# EasyEDA Pro project stm32f030f4p6_board.eprj

# Schematic Schematic1
Create Date: 2024-07-15; Page Name: P1; Project Name: stm32f030f4p6_board(1); Schematic Name: Schematic1; Update Date: 2024-07-22; Company: 嘉立创EDA; Page Size: A4; Version: V1.0
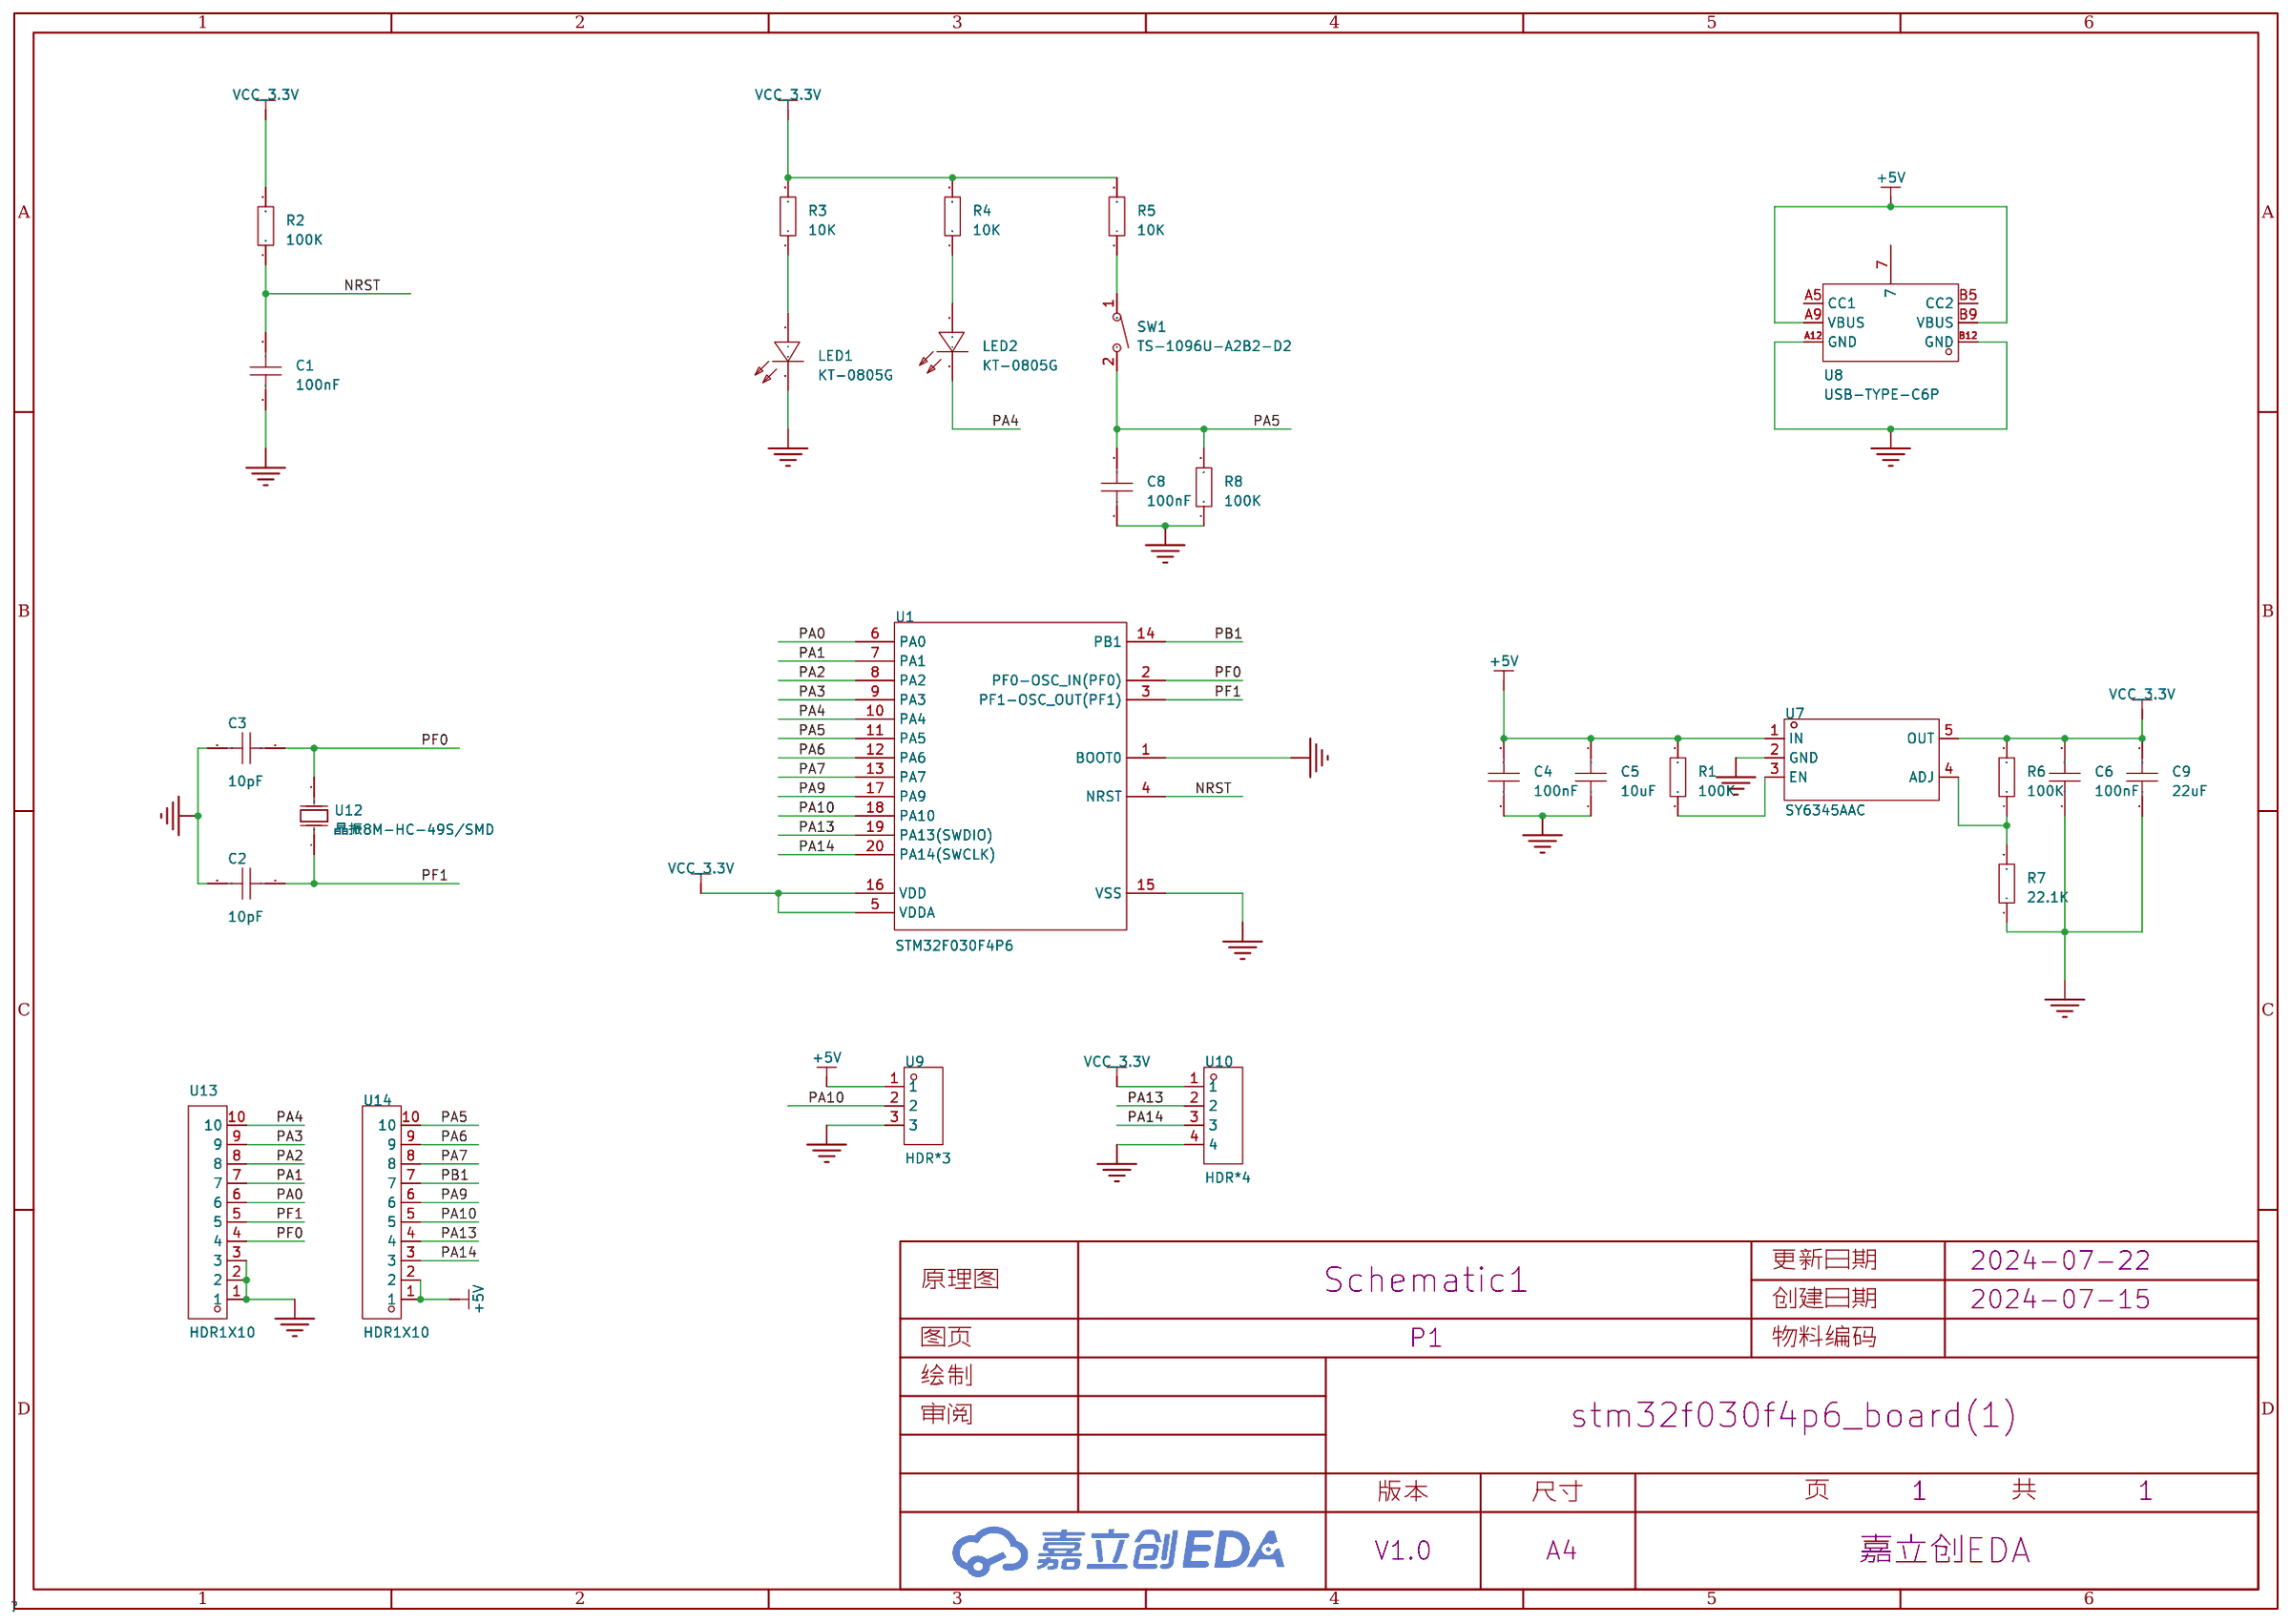
[diagram p0: schematic sheet]

## Parts
C1  100nF  [C0603]
C2  10pF  [C0603]
C3  10pF  [C0603]
C4  100nF  [C0603]
C5  10uF  [C0603]
C6  100nF  [C0603]
C8  100nF  [C0603]
C9  22uF  [C0805]
LED1  KT-0805G  [LED0805-R-RD]
LED2  KT-0805G  [LED0805-R-RD]
R1  100K  [R0603]
R2  100K  [R0603]
R3  10K  [R0603]
R4  10K  [R0603]
R5  10K  [R0603]
R6  100K  [R0603]
R7  22.1K  [R0603]
R8  100K  [R0603]
SW1  TS-1096U-A2B2-D2  [SW-SMD_L6.0-W3.3-LS6.7]
U1  STM32F030F4P6  [TSSOP-20_L6.5-W4.4-P0.65-LS6.4-BL]
U7  SY6345AAC  [SOT-23-5_L3.0-W1.7-P0.95-LS2.8-BR]
U8  USB-TYPE-C6P  [TYPE-C-SMD_TYPE-C-6P-1]
U9  HDR*3  [HDR-TH_3P-P2.54-V-M-A]
U10  HDR*4  [HDR-TH_4P-P2.54-V-F]
U12  晶振8M-HC-49S/SMD  [HC-49S_L11.4-W4.8-LS12.7]
U13  HDR1X10  [HDR-TH_10P-P2.54-V-F_C9900008052]
U14  HDR1X10  [HDR-TH_10P-P2.54-V-F_C9900008052]

## Library data of the parts
C1-C6 C8 = CAP_0603: Supplier Footprint: 0603
C9 = CAP_0805: Supplier Footprint: 0805
LED1 LED2 = KT-0805G: 灯头类型:-;发光颜色:翠绿色;正向电压(VF):-;功率:-;正向电流:-;主波长:-;二极管配置:-;透镜颜色:-;色温:-;发光强度:-;发光角度:-;载带方式:-;工作温度:-;; LCSC Part Name: 0805 翠绿 高亮; Supplier Part: C2297; Manufacturer: KENTO; Supplier Footprint: 0805; JLCPCB Part Class: 基础库; Datasheet: https://atta.szlcsc.com/upload/public/pdf/source/20170209/1486607340485.pdf; Supplier: LCSC; Emitted Color: 翠绿色
R1-R8 = Res_0603: Supplier Footprint: 0603
SW1 = TS-1096U-A2B2-D2: 电路结构:单刀单掷;按钮形状:矩形按钮;作用力:180gf;安装方式:-;开关长度:6mm;开关宽度:3.3mm;开关高度:5mm;带灯:-;机械寿命:-;; LCSC Part Name: 轻触开关3*6*5.0mm全白色包脚U型两脚贴片180gf; Supplier Part: C492868; Manufacturer: Yuandi(元迪); JLCPCB Part Class: 扩展库; Datasheet: https://atta.szlcsc.com/upload/public/pdf/source/20200316/C492864_47CE8F1A4ACE7107CDAF759D28B1DF3B.pdf; Supplier: LCSC; Circuit: 单刀单掷; Actuator Style: 矩形按钮; Operating Force: 180gf; Switch Length: 6mm; Switch Width: 3.3mm; Switch Height: 5mm
U1 = STM32F030F4P6: CPU内核:CM0;程序存储容量:16KB;RAM总容量:4KB;GPIO端口数量:15;工作电压范围:2.4V~3.6V;CPU最大主频:48MHz;程序存储器类型:FLASH;; LCSC Part Name: 基于ARM®的32位MCU，具有高达256KB的闪存，定时器，ADC，通信接口，2.4V-3.6V操作; Supplier Part: C32908; Manufacturer: ST(意法半导体); Supplier Footprint: TSSOP-20; JLCPCB Part Class: 扩展库; Datasheet: https://atta.szlcsc.com/upload/public/pdf/source/20150124/1457707258011.pdf; Supplier: LCSC; CPU Core: CM0; Program Storage Size: 16KB; RAM Size: 4KB; GPIO Ports Number: 15; Operating Voltage Range: 2.4V~3.6V; CPU Maximum Speed: 48MHz; Program Memory Type: FLASH; Operating Temperature Range: -40℃~+85℃; ADC (Bit): 12bit; Watchdog: 有; Low-Voltage Detect: 有; Direct Memory Access: 有; Internal Oscillator: 有
U7 = SY6345AAC: 输出类型:-;; Supplier Part: C98119; Manufacturer: silergy(矽力杰); Supplier Footprint: SOT-23-5; JLCPCB Part Class: 扩展库; Datasheet: https://atta.szlcsc.com/upload/public/pdf/source/20170314/1489464462463.pdf; Supplier: LCSC
U8 = USB-TYPE-C6P: Supplier Part: C9900001831; Supplier Footprint: TYPE-C_L8.94-W6.8P1.00; JLCPCB Part Class: 扩展库; Supplier: LCSC
U9 = TXM_3: Supplier Part: C9900014923; Supplier Footprint: 排针; JLCPCB Part Class: 扩展库; Supplier: LCSC
U10 = HC-08蓝牙: Supplier Part: C9900016778; Supplier Footprint: HDR-TH_4P; JLCPCB Part Class: 扩展库; Supplier: LCSC
U12 = 晶振8M-HC-49S/SMD: Supplier Part: C9900009291; Supplier Footprint: SMD; JLCPCB Part Class: 扩展库; Supplier: LCSC
U13 U14 = HDR1X10: Supplier Part: C9900008052; Supplier Footprint: 1X10P2.54mm塑高3.5mm; JLCPCB Part Class: 扩展库; Supplier: LCSC

## Nets
+5V: C4.2 C5.2 R1.1 U7.1(IN) U8.A9(VBUS) U8.B9(VBUS) U9.1 U14.1 U14.2
GND: C1.1 C2.2 C3.2 C4.1 C5.1 C6.1 C8.1 C9.1 LED1.2(K) R7.1 R8.1 U1.1(BOOT0) U1.15(VSS) U7.2(GND) U8.A12(GND) U8.B12(GND) U9.3 U10.4 U13.1 U13.2 U13.3
VCC_3.3V: C6.2 C9.2 R2.2 R3.2 R4.2 R5.2 R6.2 U1.5(VDDA) U1.16(VDD) U7.5(OUT) U10.1
NRST: C1.2 R2.1 U1.4(NRST)
PA0: U1.6(PA0) U13.6
PA1: U1.7(PA1) U13.7
PA2: U1.8(PA2) U13.8
PA3: U1.9(PA3) U13.9
PA4: LED2.2(K) U1.10(PA4) U13.10
PA5: C8.2 R8.2 SW1.2 U1.11(PA5) U14.10
PA6: U1.12(PA6) U14.9
PA7: U1.13(PA7) U14.8
PA9: U1.17(PA9) U14.6
PA10: U1.18(PA10) U9.2 U14.5
PA13: U1.19(PA13(SWDIO)) U10.2 U14.4
PA14: U1.20(PA14(SWCLK)) U10.3 U14.3
PB1: U1.14(PB1) U14.7
PF0: C3.1 U1.2(PF0-OSC_IN(PF0)) U12.2(OSC2) U13.4
PF1: C2.1 U1.3(PF1-OSC_OUT(PF1)) U12.1(OSC1) U13.5
$1N1748: LED1.1(A) R3.1
$1N1829: LED2.1(A) R4.1
$1N2327: R1.2 U7.3(EN)
$1N2395: R6.1 R7.2 U7.4(ADJ)
$1N2536: R5.1 SW1.1

Not connected (* = marked no-connect by the designer): U8 7 A5(CC1) B5(CC2)

# Board PCB1
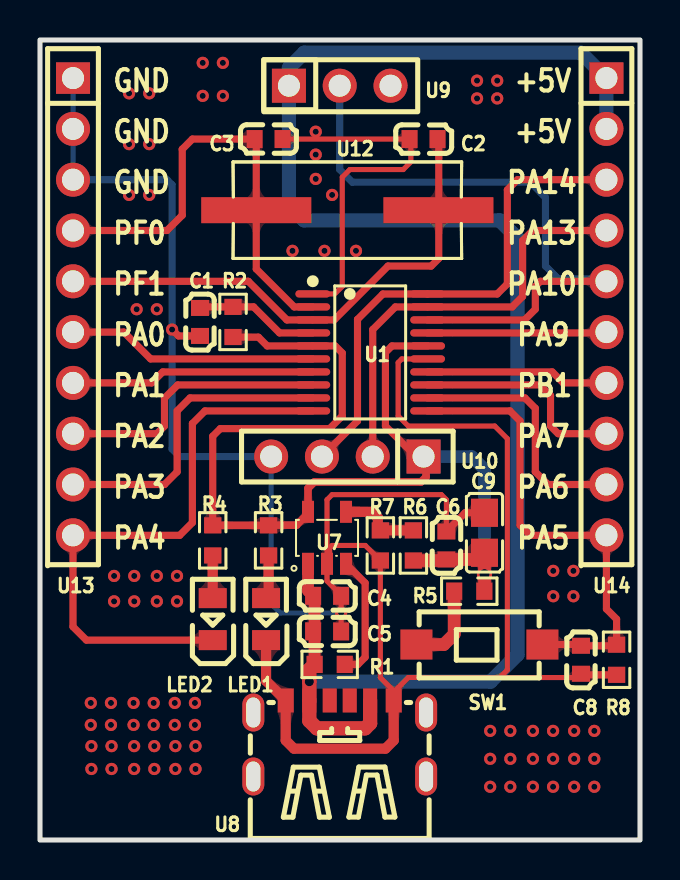
[diagram p1: board, top side]
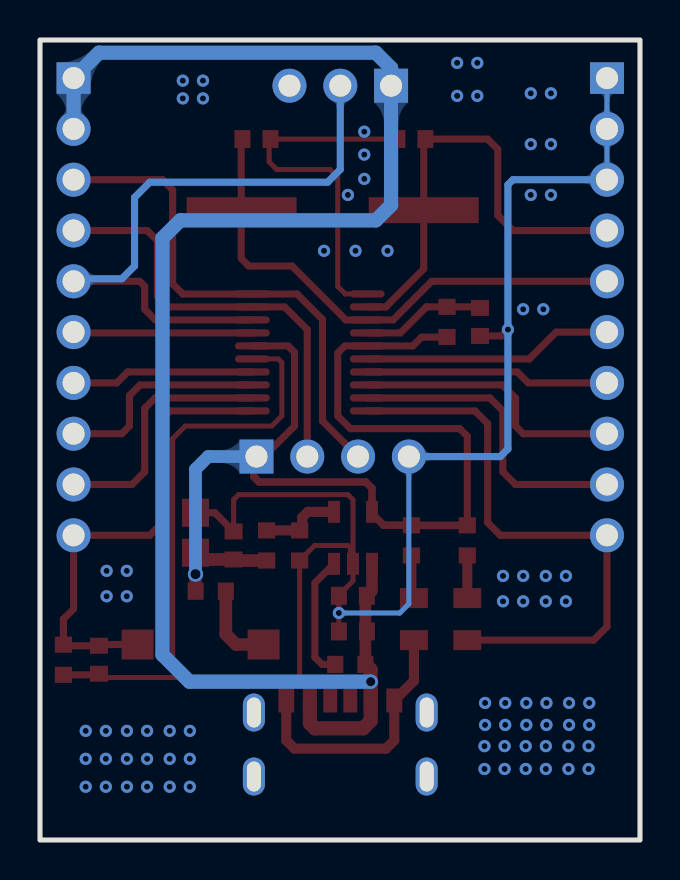
[diagram p2: board, bottom side, seen from below]

Outline 30 x 40 mm; copper layers: Top Layer, Bottom Layer. Coordinates in mm from the lower left corner of the outline.
Outline path: rectangle 0,40 30,0
Stack: Top Layer 0.035mm / Dielectric1 1.51mm FR4 er 4.5 / Bottom Layer 0.035mm

## Design rules (mm)
template: 自定义配置
spacing copperThickness1oz (default): track to track 0.102, other pairs 0.152 to 0.3
spacing copperThickness2oz: track to track 0.203, other pairs 0.152 to 0.3
track width copperThickness1oz (default): min 0.127, default 0.254, max 2.54
track width copperThickness2oz: min 0.203, default 0.254, max 2.54
differential pair differentialPair (default): width min 0.127, default 0.254, max 2.54; gap min 0.152, default 0.152
via viaSize (default): diameter min 0.5, default 0.61, max 10; hole min 0.3, default 0.305, max 6.299

## Placement (name value [footprint] x y rotation side)
C1  100nF  [C0603]  8 25.9 90 top
C2  10pF  [C0603]  19.18 35.05 180 top
C3  10pF  [C0603]  11.43 35.05 0 top
C4  100nF  [C0603]  14.36 12.21 180 top
C5  10uF  [C0603]  14.36 10.43 180 top
C6  100nF  [C0603]  20.32 14.73 270 top
C8  100nF  [C0603]  27.05 9.01 90 top
C9  22uF  [C0805]  22.22 15.36 270 top
LED1  KT-0805G  [LED0805-R-RD]  11.3 11.04 90 top
LED2  KT-0805G  [LED0805-R-RD]  8.64 11.04 90 top
R1  100K  [R0603]  14.48 8.78 0 top
R2  100K  [R0603]  9.65 25.9 270 top
R3  10K  [R0603]  11.43 14.98 90 top
R4  10K  [R0603]  8.64 14.98 90 top
R5  10K  [R0603]  21.46 12.44 0 top
R6  100K  [R0603]  18.67 14.73 270 top
R7  22.1K  [R0603]  17.02 14.73 90 top
R8  100K  [R0603]  28.83 9.01 90 top
SW1  TS-1096U-A2B2-D2  [SW-SMD_L6.0-W3.3-LS6.7]  21.97 9.77 0 top
U1  STM32F030F4P6  [TSSOP-20_L6.5-W4.4-P0.65-LS6.4-BL]  16.51 24.38 270 top
U7  SY6345AAC  [SOT-23-5_L3.0-W1.7-P0.95-LS2.8-BR]  14.35 15.11 270 top
U8  USB-TYPE-C6P  [TYPE-C-SMD_TYPE-C-6P-1]  14.99 5.08 0 top
U9  HDR*3  [HDR-TH_3P-P2.54-V-M-A]  14.99 37.71 0 top
U10  HDR*4  [HDR-TH_4P-P2.54-V-F]  15.37 19.17 180 top
U12  晶振8M-HC-49S/SMD  [HC-49S_L11.4-W4.8-LS12.7]  15.37 31.49 180 top
U13  HDR1X10  [HDR-TH_10P-P2.54-V-F_C9900008052]  1.65 26.67 270 top
U14  HDR1X10  [HDR-TH_10P-P2.54-V-F_C9900008052]  28.32 26.67 270 top

## Footprints (pads in the part's own frame, mm; a bottom-side part is the same pattern mirrored in y, then rotated)
C0603
  rect 0.8x0.9 smd: 1(-0.7,0) 2(0.7,0)
C0805
  rect 1.41x1.35 smd: 1(-1,0) 2(1,0)
HC-49S_L11.4-W4.8-LS12.7
  rect 5.5x1.3 smd: 1(-4.553,0) 2(4.553,0)
HDR-TH_3P-P2.54-V-M-A
  rect 1.7x1.7 hole 1.1: 1(-2.54,0)
  round 1.7 hole 1.1: 2(0,0) 3(2.54,0)
HDR-TH_4P-P2.54-V-F
  rect 1.7x1.7 hole 1.1: 1(-3.81,0)
  round 1.7 hole 1.1: 2(-1.27,0) 3(1.27,0) 4(3.81,0)
HDR-TH_10P-P2.54-V-F_C9900008052
  rect 1.575x1.7 hole 1.1: 1(-11.43,0)
  round 1.7 hole 1.1: 2(-8.89,0) 3(-6.35,0) 4(-3.81,0) 5(-1.27,0) 6(1.27,0) 7(3.81,0) 8(6.35,0) 9(8.89,0) 10(11.43,0)
LED0805-R-RD
  rect 1x1.399 smd: 1(1.05,0) 2(-1.05,0)
R0603
  rect 0.806x0.864 smd: 1(-0.753,0) 2(0.753,0)
SOT-23-5_L3.0-W1.7-P0.95-LS2.8-BR
  rect 1.1x0.6 smd: 1(1.3,-0.95) 2(1.3,0) 3(1.3,0.95) 4(-1.3,0.95) 5(-1.3,-0.95)
SW-SMD_L6.0-W3.3-LS6.7
  rect 1.6x1.5 smd: 1(-3.15,0) 2(3.15,0)
TSSOP-20_L6.5-W4.4-P0.65-LS6.4-BL
  oval 0.364x1.742 smd: 1(-2.925,-2.871) 2(-2.275,-2.871) 3(-1.625,-2.871) 4(-0.975,-2.871) 5(-0.325,-2.871) 6(0.325,-2.871) 7(0.975,-2.871) 8(1.625,-2.871) 9(2.275,-2.871) 10(2.925,-2.871) 11(2.925,2.871) 12(2.275,2.871) 13(1.625,2.871) 14(0.975,2.871) 15(0.325,2.871) 16(-0.325,2.871) 17(-0.975,2.871) 18(-1.625,2.871) 19(-2.275,2.871) 20(-2.925,2.871)
TYPE-C-SMD_TYPE-C-6P-1
  oval 1.1x1.9 hole 0.7x1.5: 7(-4.32,1.3) 7(-4.32,-1.9) 7(4.32,1.3) 7(4.32,-1.9)
  rect 0.7x1.2 smd: A5(-0.5,1.9) A9(1.52,1.9) B5(0.5,1.9) B9(-1.52,1.9)
  rect 0.8x1.2 smd: A12(2.7,1.9) B12(-2.7,1.9)

## Nets
As in the schematic.

Pads without a net: U8 7 A5 B5

## Via types
v1: diameter 0.61, hole 0.305, Top Layer to Bottom Layer, 79 vias
v2: diameter 0.762, hole 0.508, Top Layer to Bottom Layer, 1 via
v3: diameter 0.711, hole 0.457, Top Layer to Bottom Layer, 1 via

## Routing (per net, layer and track width the routed paths; a pad name or vN(x,y) marks a point on that pad's centre or on a via; arc(x,y) is an arc through that point)
+5V: length 82.6
  Top Layer w0.584: U7.1 13.4,12.46 C4.2 13.73,12.13 R1.1
  Top Layer w0.711: R1.1 13.47,8.52 v3(13.47,7.92) U8.B9 13.47,5.96 13.84,5.58 16.26,5.58 16.51,5.83 U8.A9
  Bottom Layer w0.711: U14.2 U14.1 27.05,39.36 13.21,39.36 12.45,38.6 U9.1 12.45,31.75 13.21,30.98 22.99,30.98 23.88,30.09 23.88,9.27 22.53,7.92 v3(13.47,7.92)
GND: length 134.3
  Top Layer w0.254: U7.2 14.35,12.95 15.06,12.24 C4.1 v1(15.06,11.35) C5.1 ; U7.2 14.48,13.94 14.48,14.6 14.6,14.73 16.26,14.73 R7.1 17.02,8.12 17.69,7.45 17.69,7.39 ; U7.2 14.35,17.01 14.6,17.27 20.07,17.27 20.32,17.01 C6.1 ; 17.69,7.39 U8.A12 ; 17.69,7.39 18.41,8.12 22.99,8.12 ; U1.1 14.74,27.3 15.11,27.68 15.11,33.14 15.49,33.52 18.16,33.52 18.54,33.9 18.54,34.98 C2.2 12.13,35.05 ; U1.15 18.09,24.05 17.91,23.87 17.91,21.2 18.41,20.7 22.74,20.7 23.37,20.07 23.37,8.5 22.99,8.12 ; 22.99,8.12 26.86,8.12 C8.1
  Top Layer w0.355: C1.1 6.92,25.2 v1(6.6,25.52) ; C9.1 21.25,16.36 C6.1 ; R8.1 27.1,8.26 C8.1
  Top Layer w0.508: U8.A12 17.69,4.98 17.27,4.57 12.7,4.57 12.29,4.98 U8.B12 11.3,7.96 LED1.2
  Bottom Layer w0.254: U10.4 11.56,11.81 12.01,11.35 v1(15.06,11.35) ; U13.1 U13.2 U13.3
  Bottom Layer w0.355: U10.4 6.98,19.17 6.6,19.55 v1(6.6,25.52) 6.6,32.76 6.35,33.02 U13.3
  vias: v1(2.54,6.85) v1(2.54,5.75) v1(2.57,4.69) v1(2.57,3.55) v1(3.55,6.85) v1(3.55,5.75) v1(3.58,4.69) v1(3.58,3.55) v1(3.7,13.2) v1(3.7,11.93) v1(4.45,37.33) v1(4.45,34.79) v1(4.45,32.25) v1(4.71,13.2) v1(4.71,11.93) v1(4.68,6.85) v1(4.68,5.75) v1(4.71,4.69) v1(4.71,3.55) v1(4.83,26.54) v1(5.46,37.33) v1(5.46,34.79) v1(5.46,32.25) v1(5.69,6.85) v1(5.69,5.75) v1(5.71,4.69) v1(5.71,3.55) v1(5.84,26.54) v1(5.84,13.2) v1(5.84,11.93) v1(6.74,6.85) v1(6.74,5.75) v1(6.85,13.2) v1(6.85,11.93) v1(6.77,4.69) v1(6.77,3.55) v1(7.75,6.85) v1(7.75,5.75) v1(7.78,4.69) v1(7.78,3.55) v1(8.14,38.86) v1(8.14,37.21) v1(9.14,38.86) v1(9.14,37.21) v1(12.62,29.46) v1(13.79,35.41) v1(13.79,34.27) v1(13.79,33.06) v1(14.22,29.46) v1(14.6,32.25) v1(15.8,29.46) v1(21.85,37.97) v1(21.85,37.08) v1(22.51,5.46) v1(22.51,4.06) v1(22.51,2.66) v1(22.86,37.97) v1(22.86,37.08) v1(23.52,5.46) v1(23.52,4.06) v1(23.52,2.66) v1(24.65,5.46) v1(24.65,4.06) v1(24.65,2.66) v1(25.66,13.46) v1(25.66,12.19) v1(25.65,5.46) v1(25.65,4.06) v1(25.65,2.66) v1(26.67,13.46) v1(26.67,12.19) v1(26.71,5.46) v1(26.71,4.06) v1(26.71,2.66) v1(27.72,5.46) v1(27.72,4.06) v1(27.72,2.66)
VCC_3.3V: length 56.4
  Top Layer w0.355: U1.16 17.6,24.7 17.27,24.38 17.27,20.7 18.8,19.17 U10.1 ; R2.2 9.66,25.14 10.92,25.14 11.36,24.7 U1.5 14.76,24.7 15.11,24.35 15.11,21.2 14.48,20.57 9.02,20.57 8.64,20.19 R4.2
  Top Layer w0.381: U10.1 19.3,19.05 19.3,18.16 19.05,17.9 13.72,17.9 13.4,17.59 U7.5 13.4,16.32 12.83,15.74 11.44,15.74 R3.2 R4.2
  Top Layer w0.635: R5.2 22.22,12.45 v2(22.22,13.29) C9.2 21.89,14.03 C6.2 20.27,13.97 R6.2
  Bottom Layer w0.635: v2(22.22,13.29) 22.22,18.54 21.59,19.17 U10.1
NRST: length 6.2
  Top Layer w0.355: U1.4 11.98,25.35 10.68,26.66 R2.1 8.05,26.66 C1.2
PA0: length 12.5
  Top Layer w0.355: U13.6 4.19,25.39 5.53,24.05 U1.6
PA1: length 12.2
  Top Layer w0.355: U13.7 5.59,22.86 6.14,23.4 U1.7
PA2: length 13.8
  Top Layer w0.355: U13.8 5.84,20.31 6.22,20.7 6.22,22.09 6.88,22.75 U1.8
PA3: length 15.6
  Top Layer w0.355: U13.9 6.22,17.78 6.86,18.41 6.86,21.46 7.5,22.1 U1.9
PA4: length 29.3
  Top Layer w0.355: LED2.2 2.32,9.99 1.65,10.66 U13.10 6.98,15.23 7.62,15.87 7.62,20.82 8.25,21.45 U1.10
PA5: length 24
  Top Layer w0.355: SW1.2 26.99,9.77 C8.2 28.78,9.71 R8.2 28.83,11.04 28.32,11.55 U14.10 24.51,15.23 24,15.74 24,20.95 23.5,21.45 U1.11
PA6: length 12.6
  Top Layer w0.355: U1.12 24.25,22.1 24.76,21.59 24.76,18.41 25.4,17.78 U14.9
PA7: length 10.8
  Top Layer w0.355: U1.13 24.99,22.75 25.53,22.22 25.53,20.7 25.91,20.31 U14.8
PA9: length 9
  Top Layer w0.355: U1.17 28.28,25.35 U14.6
PA10: length 32.3
  Top Layer w0.355: U1.18 24.23,26 24.76,26.54 24.76,27.68 25.02,27.94 U14.5
  Bottom Layer w0.355: U14.5 28.19,28.06 25.91,28.06 25.27,28.7 25.27,32.13 24.51,32.89 15.62,32.89 14.99,33.52 U9.2
PA13: length 21.7
  Top Layer w0.355: U10.2 16.64,25.52 17.77,26.65 U1.19 23.61,26.65 24.13,27.17 24.13,29.97 24.64,30.47 U14.4
PA14: length 25.7
  Top Layer w0.355: U14.3 23.88,33.02 23.37,32.51 23.37,27.81 22.86,27.3 19.38,27.3 ; U10.3 15.88,20.95 15.88,26.03 17.14,27.3 19.38,27.3 ; 19.38,27.3 U1.20
PB1: length 9.2
  Top Layer w0.355: U1.14 25.61,23.4 26.16,22.86 U14.7
PF0: length 23
  Top Layer w0.355: U13.4 6.35,30.47 7.11,31.24 7.11,34.54 7.62,35.05 C3.1 10.81,34.96 U12.2 10.81,28.55 12.71,26.65 U1.2
PF1: length 26.4
  Top Layer w0.254: 19.94,31.47 U12.1
  Top Layer w0.355: C2.1 19.94,34.98 19.94,29.08 19.56,28.7 17.4,28.7 14.71,26 U1.3 12.34,26 10.41,27.94 U13.5
$1N1748: length 2.2
  Top Layer w0.508: R3.1 11.43,12.22 LED1.1
$1N1829: length 2.1
  Top Layer w0.508: R4.1 LED2.1
$1N2327: length 6.2
  Top Layer w0.355: U7.3 16.26,12.85 16.26,9.14 15.9,8.78 R1.2
$1N2395: length 4.1
  Top Layer w0.508: U7.4 16.61,16.41 16.89,16.12 16.89,15.61 R7.2 R6.1
$1N2536: length 4.3
  Top Layer w0.635: R5.1 20.71,10.29 20.19,9.77 SW1.1

## Copper pours and planes (outline as drawn; the poured copper is in the pictures)
GND on Top Layer: 7.62,36.19 7.62,28.2 8.62,27.2 22.47,27.2 22.97,27.7 22.97,35.7 22.48,36.19
GND on Top Layer: 0.25,39.75 0.25,0.38 0.38,0.25 29.59,0.25 29.72,0.38 29.72,39.49 29.46,39.75 24.38,39.75 24.26,39.62 24.26,27.92 23,26.65 10.81,26.65 10.67,26.79 7.11,26.79 6.86,27.05 6.86,36.19 7.24,36.57 23.62,36.57 23.88,36.83 23.88,39.62 23.75,39.75
GND on Bottom Layer: 0.25,39.75 0.25,0.38 0.38,0.25 29.59,0.25 29.72,0.38 29.72,39.49 29.46,39.75

Small or netless copper shapes (teardrops, artwork), in the pictures only: 123 on Top Layer, 17 on Bottom Layer

## Text on the board
Top Silkscreen Layer: GND | PF0 | PF1 | PA0 | PA1 | PA2 | PA3 | PA4 | PA14 | PA13 | PA10 | +5V | PA9 | PB1 | PA7 | PA6 | PA5
